# EasyEDA schematic Rollator_2020-08-26_12-51-18.json
TITLE: Rollator; REV: 1.0; Date: 2020-08-06; Sheet: 1/1; Drawn By: grizzie17; Company: Me
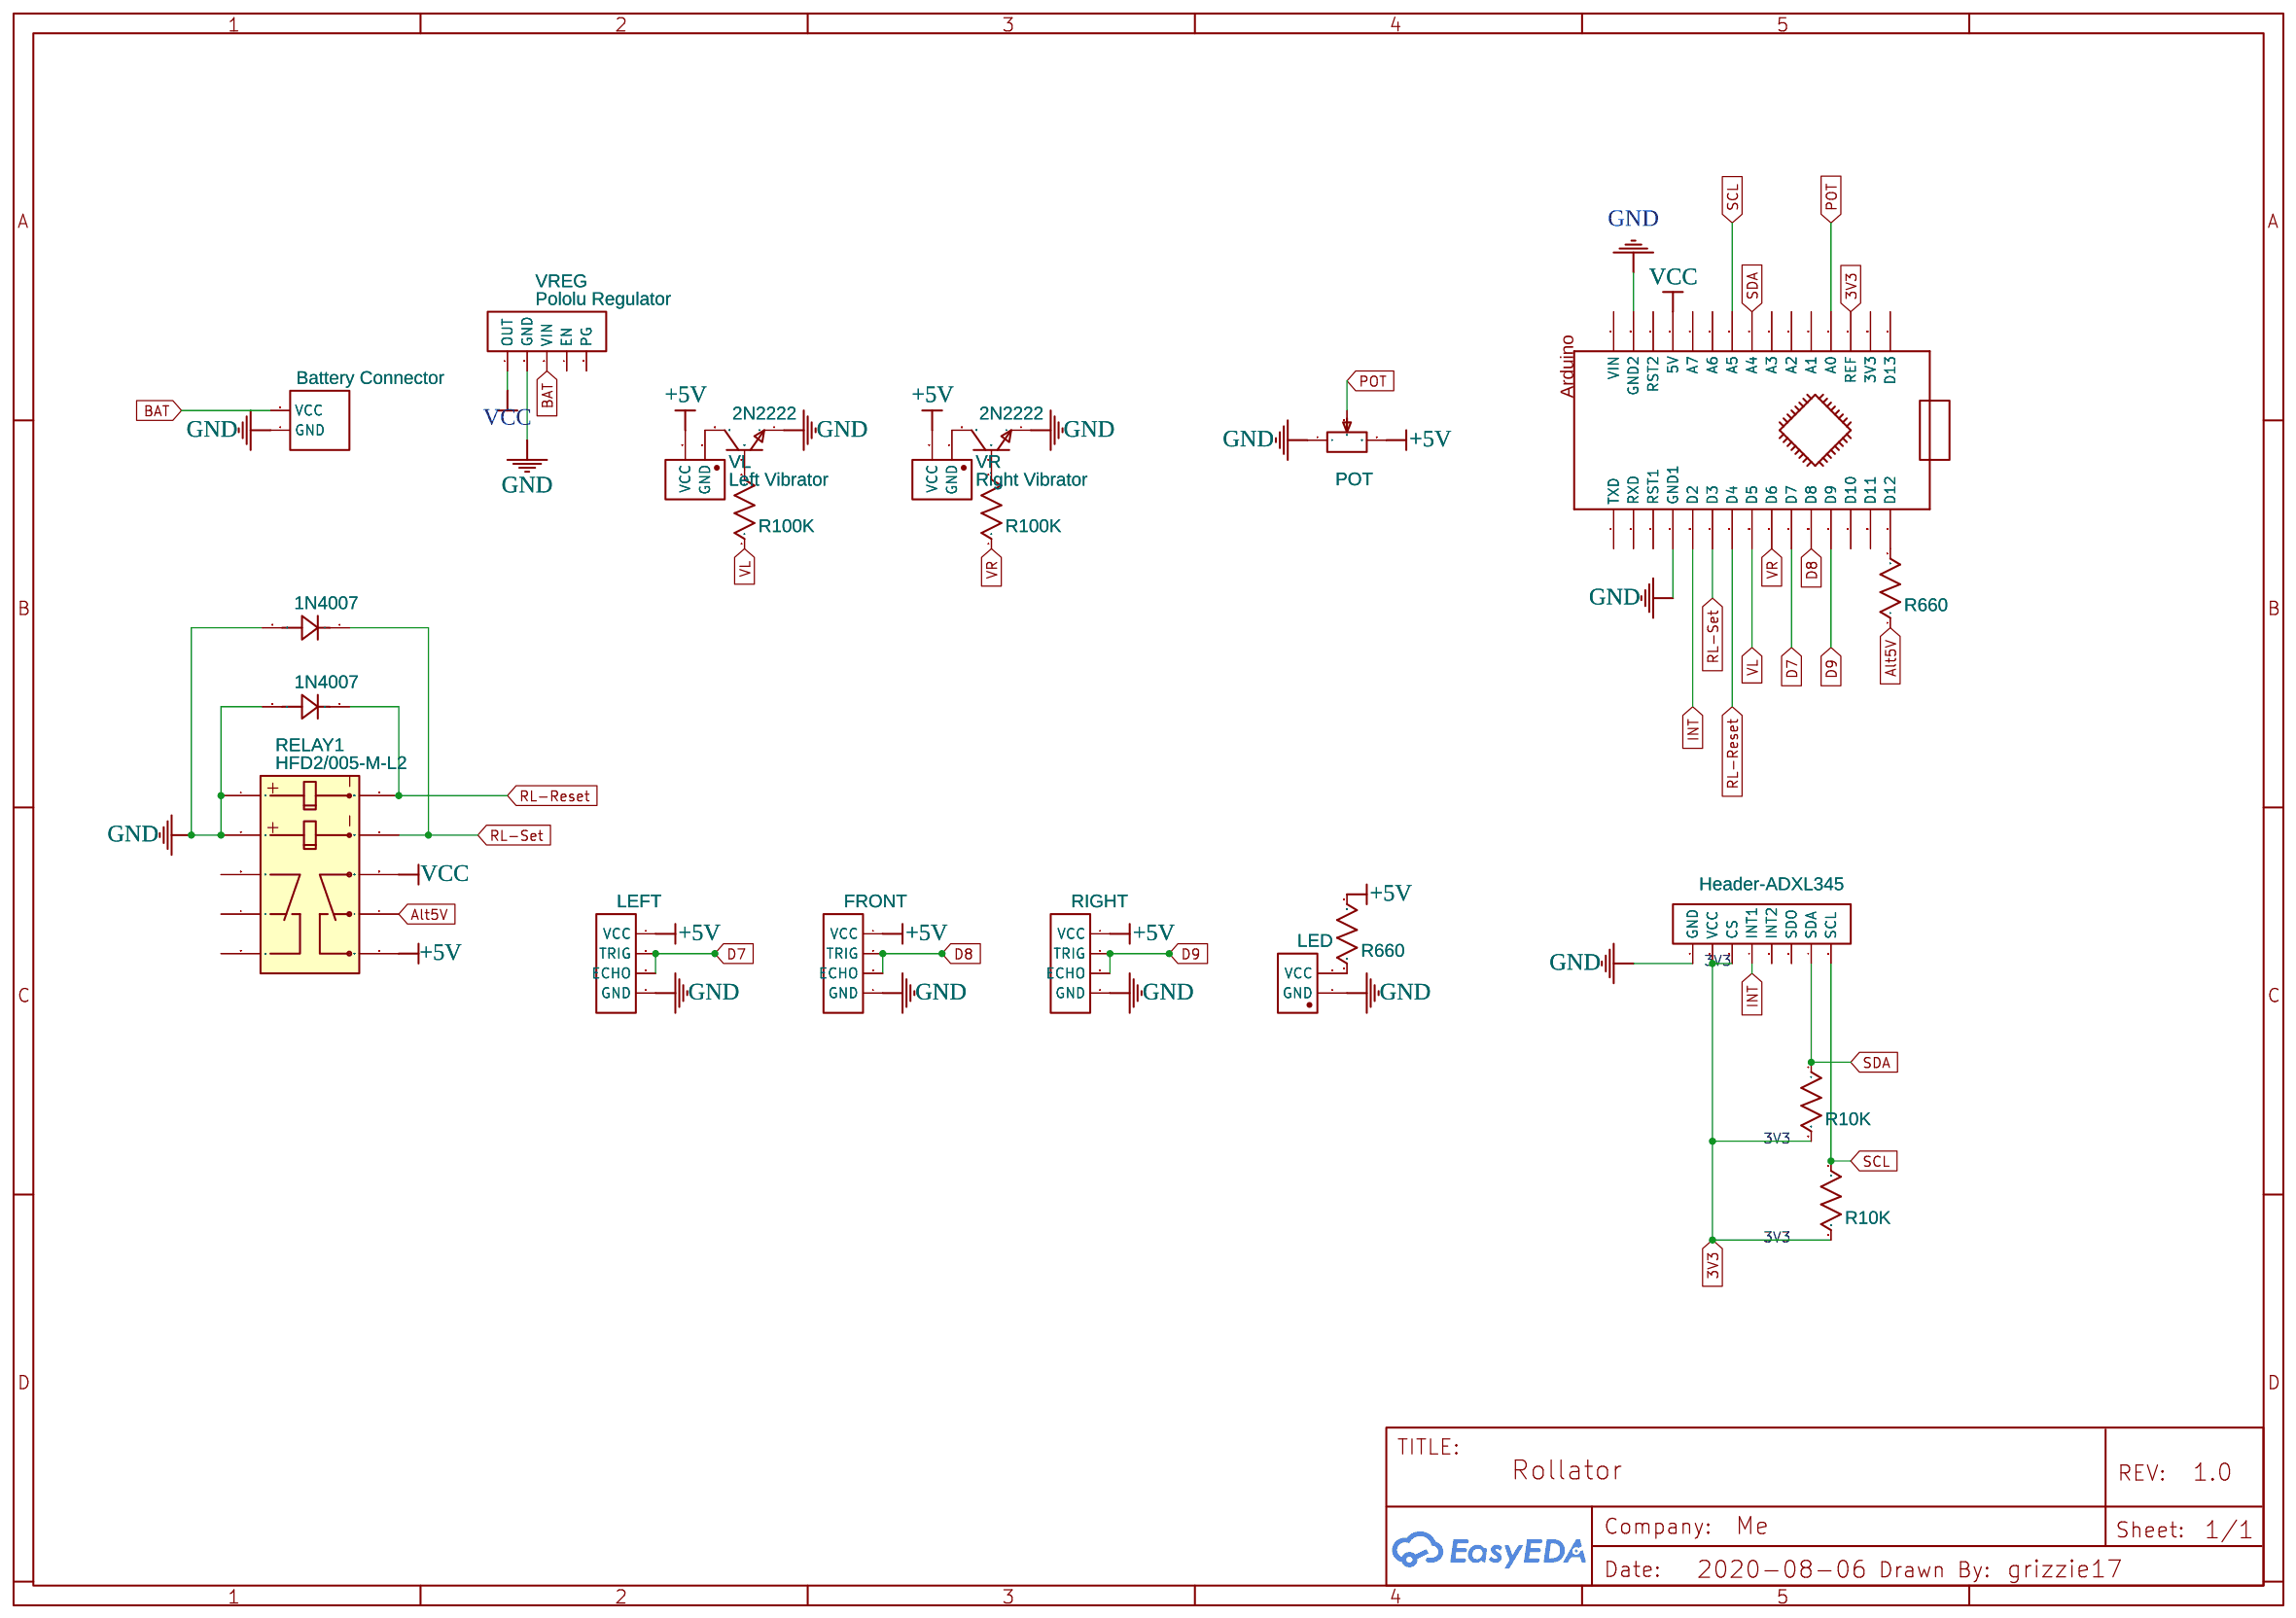
[diagram p0: schematic sheet]

## Parts
ACL  Header-ADXL345  [HDR-TH_8P-P2.54-V]
D1  1N4007  [DIODE]
D2  1N4007  [DIODE]
LED  LED  [HEADER_FEMALE_1X2_2.54]
P1  LEFT  [HDR-4X1/2.54]
P2  FRONT  [HDR-4X1/2.54]
P3  RIGHT  [HDR-4X1/2.54]
Q1  2N2222  [TO-92-3_L4.9-W3.7-P1.27-L]
Q2  2N2222  [TO-92-3_L4.9-W3.7-P1.27-L]
R3  POT  [RES-ADJ-TH_3P-L9.5-W9.5-P2.50-L_3386P]
R10K-3  R10K  [R100K]
R10K-4  R10K  [R100K]
R100K-1  R100K  [R100K]
R100K-2  R100K  [R100K]
R660-1  R660  [R100K]
R660-2  R660  [R100K]
RELAY1  HFD2/005-M-L2  [RELAY-HF_15]
U3  Battery Connector  [BATTERY CONNECTOR]
UC1  Arduino_Nano_v3  [ARDUINO_NANO_V3]
VL  Left Vibrator  [HEADER_FEMALE_1X2_2.54]
VR  Right Vibrator  [HEADER_FEMALE_1X2_2.54]
VREG  Pololu Regulator  [HDR-TH_5P-P2.54-V]

## Library data of the parts
ACL = Header-Female-2.54_1x8: Supplier: LCSC; Manufacturer: BOOMELE; Manufacturer Part: Female headerHDR1X8-2.54; Supplier Part: C27438; Package Display: No
D1 D2 = DIODE 1N4007: Manufacturer Part: 1N4007G+ DIODE; Contributor: cc_CGB; Supplier Part: 267-5047; Supplier: Element14; link: http://www.farnell.com/datasheets/2311128.pdf?_ga=2.143268789.1251301912.1525072853-258607356.1495180379
LED = Header_Female_1X2_2_54: catid: 20; Contributor: Moile-EasyEDA; sim: true; Package Display: No
P1-P3 = Header-Female-2.54_1x4: Supplier: LCSC; Manufacturer: ReliaPro; Supplier Part: C124413; Package Display: No
Q1 Q2 = 2N2222: Supplier: LCSC; Manufacturer: SEMTECH; Contributor: LCSC; Supplier Part: C118536
R3 = 3386P-1-202_C330453: Supplier: LCSC; Supplier Part: C330453; Manufacturer: Chengdu Guosheng Tech; Manufacturer Part: 3386P-1-202; Resistance(Ohms): 2K; Contributor: LCSC
R10K-3 R10K-4 R100K-1 R100K-2 R660-1 R660-2 = 100K: sourceId: zmSasKEkC; sim: true; Contributor: Ashwinkmenon
RELAY1 = HFD2/005-M-L2: Supplier: LCSC; Manufacturer: HF; Manufacturer Part: HFD2/003-S-L2; Contributor: LCSC; Supplier Part: C69851
U3 = Battery Connector: Contributor: circuitmaker5000
UC1 = Arduino_Nano_v3: Manufacturer Part: arduino_nano1; Contributor: mali oglasi
VL VR = Header_Female_1X2_2_54: catid: 20; Contributor: Moile-EasyEDA; sim: true
VREG = Header-Female-2.54_1x5: Supplier: LCSC; Manufacturer: BOOMELE; Manufacturer Part: 2.54mm 1*5p Female header; image: //image.lceda.cn/szlcsc/C50950.jpg; Supplier Part: C50950; Package Display: No

## Nets
3V3: ACL.2(VCC) ACL.3(CS) R10K-3.2 R10K-4.2 UC1.REF
+5V: P1.4(VCC) P2.4(VCC) P3.4(VCC) R3.3 R660-1.2 RELAY1.6 VL.2(VCC) VR.2(VCC)
GND: ACL.1(GND) D1.2 D2.2 LED.1(GND) P1.1(GND) P2.1(GND) P3.1(GND) Q1.1(E) Q2.1(E) R3.1 RELAY1.1 RELAY1.2 U3.1(GND) UC1.GND1 UC1.GND2 VREG.2(GND)
VCC: RELAY1.8 UC1.5V VREG.1(OUT)
Alt5V: R660-2.1 RELAY1.7
BAT: U3.2(VCC) VREG.3(VIN)
D7: P1.2(ECHO) P1.3(TRIG) UC1.D7
D8: P2.2(ECHO) P2.3(TRIG) UC1.D8
D9: P3.2(ECHO) P3.3(TRIG) UC1.D9
INT: ACL.4(INT1) UC1.D2
POT: R3.2 UC1.A0
RL-Reset: D1.1 RELAY1.10 UC1.D4
RL-Set: D2.1 RELAY1.9 UC1.D3
SCL: ACL.8(SCL) R10K-3.1 UC1.A5
SDA: ACL.7(SDA) R10K-4.1 UC1.A4
VL: R100K-1.1 UC1.D5
VR: R100K-2.1 UC1.D6
Net-(LED-2): LED.2(VCC) R660-1.1
Net-(Q1-2): Q1.2(B) R100K-1.2
Net-(Q1-3): Q1.3(C) VL.1(GND)
Net-(Q2-2): Q2.2(B) R100K-2.2
Net-(Q2-3): Q2.3(C) VR.1(GND)
Net-(R660-2-2): R660-2.2 UC1.D12

Not connected (* = marked no-connect by the designer): ACL 5(INT2) 6(SDO); RELAY1 3 4 5; UC1 3V3 A1 A2 A3 A6 A7 D10 D11 D13 RST1 RST2 RX(RXD) TX(TXD) VIN; VREG 4(EN) 5(PG)
